# EAGLE design TiltyDuo (EAGLE 6.4)
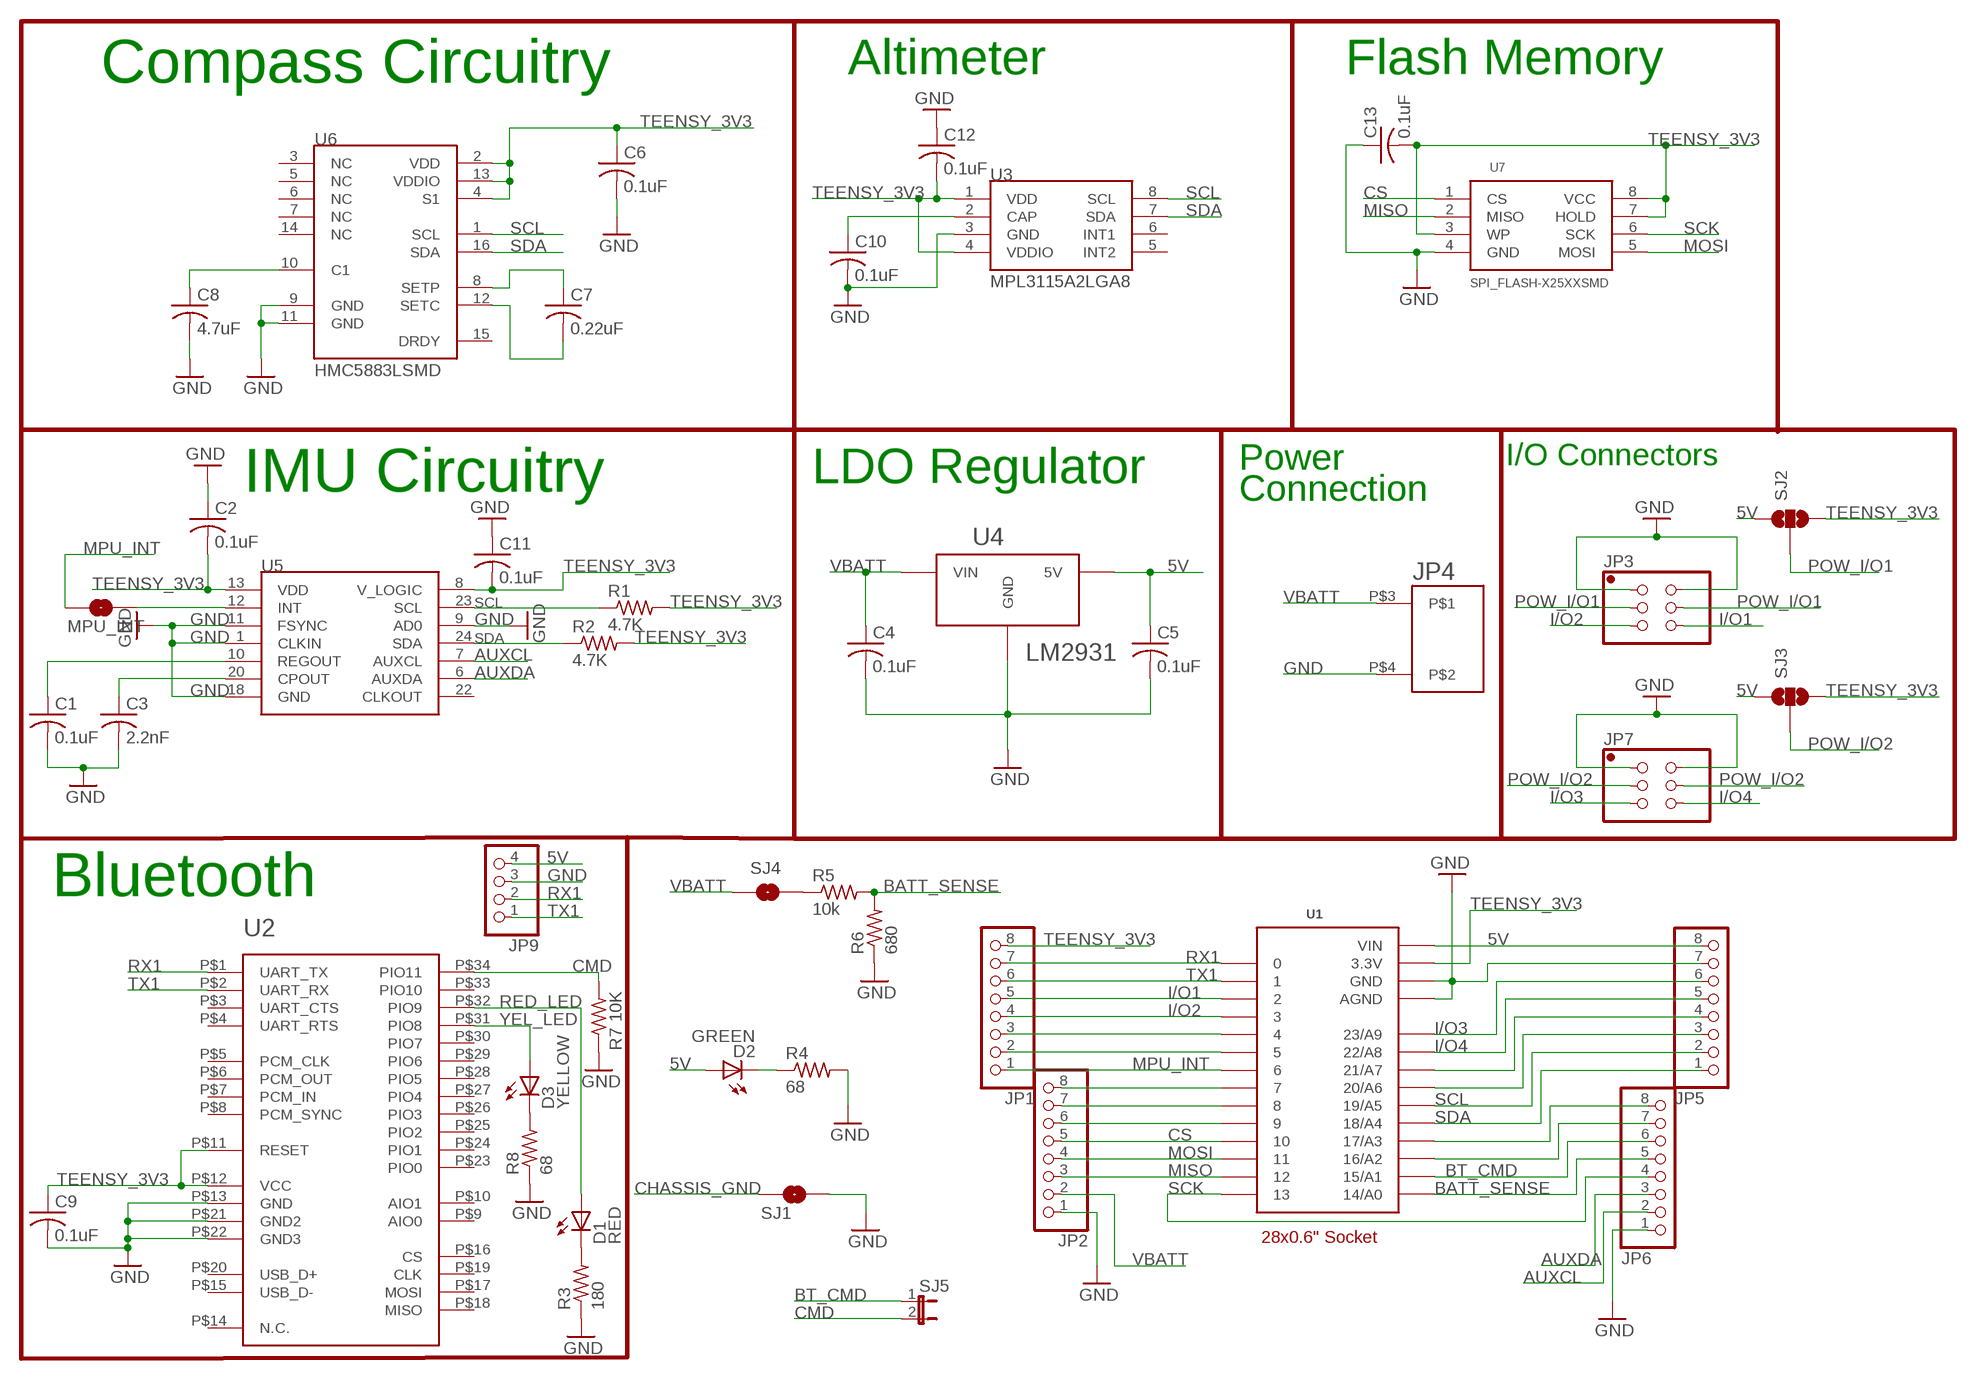
[diagram p0: schematic, sheet 1]

## Parts
C1  0.1uF  C-USC0603  [C0603]
C2  0.1uF  C-USC0603  [C0603]
C3  2.2nF  C-USC0603  [C0603]
C4  0.1uF  C-USC0603  [C0603]
C5  0.1uF  C-USC0603  [C0603]
C6  0.1uF  C-USC0603  [C0603]
C7  0.22uF  C-USC0603  [C0603]
C8  4.7uF  C-USC0603  [C0603]
C9  0.1uF  C-USC0603  [C0603]
C10  0.1uF  C-USC0603  [C0603]
C11  0.1uF  C-USC0603  [C0603]
C12  0.1uF  C-USC0603  [C0603]
C13  0.1uF  C-USC0603  [C0603]
D1  RED  LED-GREENLED-0805_NO_SILK  [LED-0805]
D2  GREEN  LED-GREENLED-0805_NO_SILK  [LED-0805]
D3  YELLOW  LED-GREENLED-0805_NO_SILK  [LED-0805]
JP1  PINHD-1X81X08_NO_SILK_LOCK  [1X08_NO_SS_LOCKING]
JP2  PINHD-1X81X08_NO_SILK_LOCK  [1X08_NO_SS_LOCKING]
JP3  PINHD-2X32X03_NO_SS_LOCK  [2X03_NO_SS_LOCK]
JP4  2-POS_SMD_TERM_BLOCK  [2-POS_SMD_TERMINAL_BLOCK]
JP5  PINHD-1X81X08_NO_SILK_LOCK  [1X08_NO_SS_LOCKING]
JP6  PINHD-1X81X08_NO_SILK_LOCK  [1X08_NO_SS_LOCKING]
JP7  PINHD-2X32X03_NO_SS_LOCK  [2X03_NO_SS_LOCK]
JP9  PINHD-1X41X04_NO_SS_LOCKING  [1X04_NO_SS_LOCKING]
MPU_INT  SOLDERJUMPERNO  [SJ_2S-NO]
R1  4.7K  R-US_R0603  [R0603]
R2  4.7K  R-US_R0603  [R0603]
R3  180  R-US_R0603  [R0603]
R4  68  R-US_R0603  [R0603]
R5  10k  R-US_R0603  [R0603]
R6  680  R-US_R0603  [R0603]
R7  10K  R-US_R0603  [R0603]
R8  68  R-US_R0603  [R0603]
SJ1  SOLDERJUMPERNO  [SJ_2S-NO]
SJ2  SOLDERJUMPER_2WAYS  [SJ_3]
SJ3  SOLDERJUMPER_2WAYS  [SJ_3]
SJ4  SOLDERJUMPERTRACE  [SJ_2S-TRACE]
SJ5  JUMPER-2SMD-NC  [SJ_2S]
U1  TEENSY_3.0_OUTER-PINS28-DIP_SOCKET  [28-DIP]
U2  HC-09_BREAKOUT  [HC-09_BREAKOUT]
U3  MPL3115A2LGA8  [LGA8]
U4  LM2931  [TO263]
U5  MPU-6050  [QFN-24]
U6  HMC5883LSMD  [16LPCC]
U7  SPI_FLASH-X25XXSMD  [SO08]

## Nets
5V: C5.1 D2.1(A) JP5.8 JP9.4 SJ2.1 SJ3.1 U1.P$15(VIN) U4.P$3(5V)
AUXCL [I/O]: JP6.2 U5.7(AUXCL)
AUXDA [I/O]: JP6.3 U5.6(AUXDA)
BATT_SENSE: JP6.5 R5.2 R6.2 U1.P$27(14/A0)
BT_CMD: JP6.6 SJ5.1 U1.P$26(15/A1)
CHASSIS_GND: SJ1.1
CMD: R7.2 SJ5.2 U2.P$34(PIO11)
CS: JP2.5 U1.P$12 U7.1(CS)
GND: C1.2 C2.1 C3.2 C4.2 C5.2 C6.2 C8.2 C9.2 C10.2 C11.1 C12.1 C13.1 JP2.1 JP3.1 JP3.2 JP4.P$4 JP5.7 JP6.1 JP7.1 JP7.2 JP9.3 R3.1 R4.2 R6.1 R7.1 R8.1 SJ1.2 U1.P$1(GND) U1.P$16(AGND) U2.P$13(GND) U2.P$21(GND2) U2.P$22(GND3) U3.3(GND) U4.P$1(GND) U5.1(CLKIN) U5.9(AD0) U5.11(FSYNC) U5.18(GND) U6.9(GND) U6.11(GND) U7.4(GND)
I/O1: JP1.5 JP3.6 U1.P$4
I/O2: JP1.4 JP3.5 U1.P$5
I/O3: JP5.6 JP7.5 U1.P$18(23/A9)
I/O4: JP5.5 JP7.6 U1.P$19(22/A8)
MISO: JP2.3 U1.P$14 U7.2(MISO)
MOSI: JP2.4 U1.P$13 U7.5(MOSI)
MPU_INT: JP1.1 MPU_INT.1 U1.P$8
N$1: C1.1 U5.10(REGOUT)
N$2: C3.1 U5.20(CPOUT)
N$3: D1.2(C) R3.2
N$5: C7.1 U6.8(SETP)
N$6: C7.2 U6.12(SETC)
N$7: JP1.3 U1.P$6
N$8: JP1.2 U1.P$7
N$9: R5.1 SJ4.2
N$10: JP6.8 U1.P$24(17/A3)
N$11: C8.1 U6.10(C1)
N$12: JP2.6 U1.P$11
N$13: D2.2(C) R4.1
N$16: MPU_INT.2 U5.12(INT)
N$18: JP5.4 U1.P$20(21/A7)
N$19: JP5.3 U1.P$21(20/A6)
N$21: C10.1 U3.2(CAP)
N$23: JP6.7 U1.P$25(16/A2)
N$24: D3.2(C) R8.2
POW_I/O1: JP3.3 JP3.4 SJ2.2
POW_I/O2: JP7.3 JP7.4 SJ3.2
RED_LED: D1.1(A) U2.P$32(PIO9)
RX1: JP1.7 JP9.2 U1.P$2 U2.P$1(UART_TX)
RX3: JP2.8 U1.P$9
SCK: JP6.4 U1.P$28 U7.6(SCK)
SCL [I/O]: JP5.2 R1.1 U1.P$22(19/A5) U3.8(SCL) U5.23(SCL) U6.1(SCL)
SDA [I/O]: JP5.1 R2.1 U1.P$23(18/A4) U3.7(SDA) U5.24(SDA) U6.16(SDA)
TEENSY_3V3 [3.3V]: C2.2 C6.1 C9.1 C11.2 C12.2 C13.2 JP1.8 R1.2 R2.2 SJ2.3 SJ3.3 U1.P$17(3.3V) U2.P$11(RESET) U2.P$12(VCC) U3.1(VDD) U3.4(VDDIO) U5.8(V_LOGIC) U5.13(VDD) U6.2(VDD) U6.4(S1) U6.13(VDDIO) U7.3(WP) U7.7(HOLD) U7.8(VCC)
TX1: JP1.6 JP9.1 U1.P$3 U2.P$2(UART_RX)
TX3: JP2.7 U1.P$10
VBATT: C4.1 JP2.2 JP4.P$3 SJ4.1 U4.P$2(VIN)
YEL_LED: D3.1(A) U2.P$31(PIO8)
Unconnected: U2.P$3(UART_CTS) U2.P$4(UART_RTS) U2.P$5(PCM_CLK) U2.P$6(PCM_OUT) U2.P$7(PCM_IN) U2.P$8(PCM_SYNC) U2.P$9(AIO0) U2.P$10(AIO1) U2.P$14(N.C.) U2.P$15(USB_D-) U2.P$16(CS) U2.P$17(MOSI) U2.P$18(MISO) U2.P$19(CLK) U2.P$20(USB_D+) U2.P$23(PIO0) U2.P$24(PIO1) U2.P$25(PIO2) U2.P$26(PIO3) U2.P$27(PIO4) U2.P$28(PIO5) U2.P$29(PIO6) U2.P$30(PIO7) U2.P$33(PIO10) U3.5(INT2) U3.6(INT1) U5.22(CLKOUT) U6.3(NC) U6.5(NC) U6.6(NC) U6.7(NC) U6.14(NC) U6.15(DRDY)

## Notes on the sheet
- Compass Circuitry | Altimeter | Flash Memory
- Power | I/O Connectors
- IMU Circuitry | LDO Regulator
- Connection
- Bluetooth
- 28x0.6" Socket

## Library data of the parts
C1 C6 C9 C10 C13 = resistor:C-US: CAPACITOR, American symbol; RATED_VOLTAGE: 2
C2 C4 C5 C11 C12 = resistor:C-US: CAPACITOR, American symbol
C3 = resistor:C-US: CAPACITOR, American symbol; RATED_VOLTAGE: 50
C7 C8 = resistor:C-US: CAPACITOR, American symbol; ESR: <200mOhms
D1-D3 = SparkFun-LED:LED-GREEN: Various green LEDs 0603- DIO-00821 LARGE- DIO-00862 LILYPAD- DIO-09910
JP1 JP2 JP5 JP6 = pinhead:PINHD-1X8: PIN HEADER
JP3 JP7 = pinhead:PINHD-2X3: PIN HEADER
JP4 = My Parts:2-POS_SMD_TERM_BLOCK; PART#: 277-2337-1-ND; POSSIBLE_ALT: 009276002021106
JP9 = pinhead:PINHD-1X4: PIN HEADER
MPU_INT SJ1 SJ4 = SparkFun-Passives:SOLDERJUMPER: Solder Jumper Standard SMD solder jumper. Used to automate production. Two varients : Normally Open and Normally Closed are the same, but have different paste layers. NC will have a large amount of paste and should jumper during reflow.
R1-R8 = resistor:R-US_: RESISTOR, American symbol
SJ2 SJ3 = SparkFun-Passives:SOLDERJUMPER_2WAY: Solder Jumper 2 way solder jumper
SJ5 = SparkFun-Passives:JUMPER-2: Jumper Basic 0.1" spaced jumper. Use with breakaway headers.
U1 = My Parts:TEENSY_3.0_OUTER-PINS; COST: 0.28; PART#: AE10004-ND; PART#2: A28-LC-TR-R
U2 = csr:HC-09_BREAKOUT
U3 = SparkFun-Sensors:MPL3115A2: Altimeter/Pressure Sensor, I2C, 1.95V-3.6V supply, 50 to 110kPa
U4 = on-semiconductor:LM2931; COST: 0.53
U5 = SparkFun-Sensors:MPU-6050: MPU-6000 - I2C address is 0x68 with AD0 low and 0x69 with AD0 high.
U6 = SparkFun:HMC5883L: 3 Axis Digital Compass IC
U7 = SparkFun-DigitalIC:SPI_FLASH-X25XX: 8pin SPI Flash series x25xx. Works with devices like W25X32 and BR25L32; PART#: S25FL204K0TMFI043

## Board
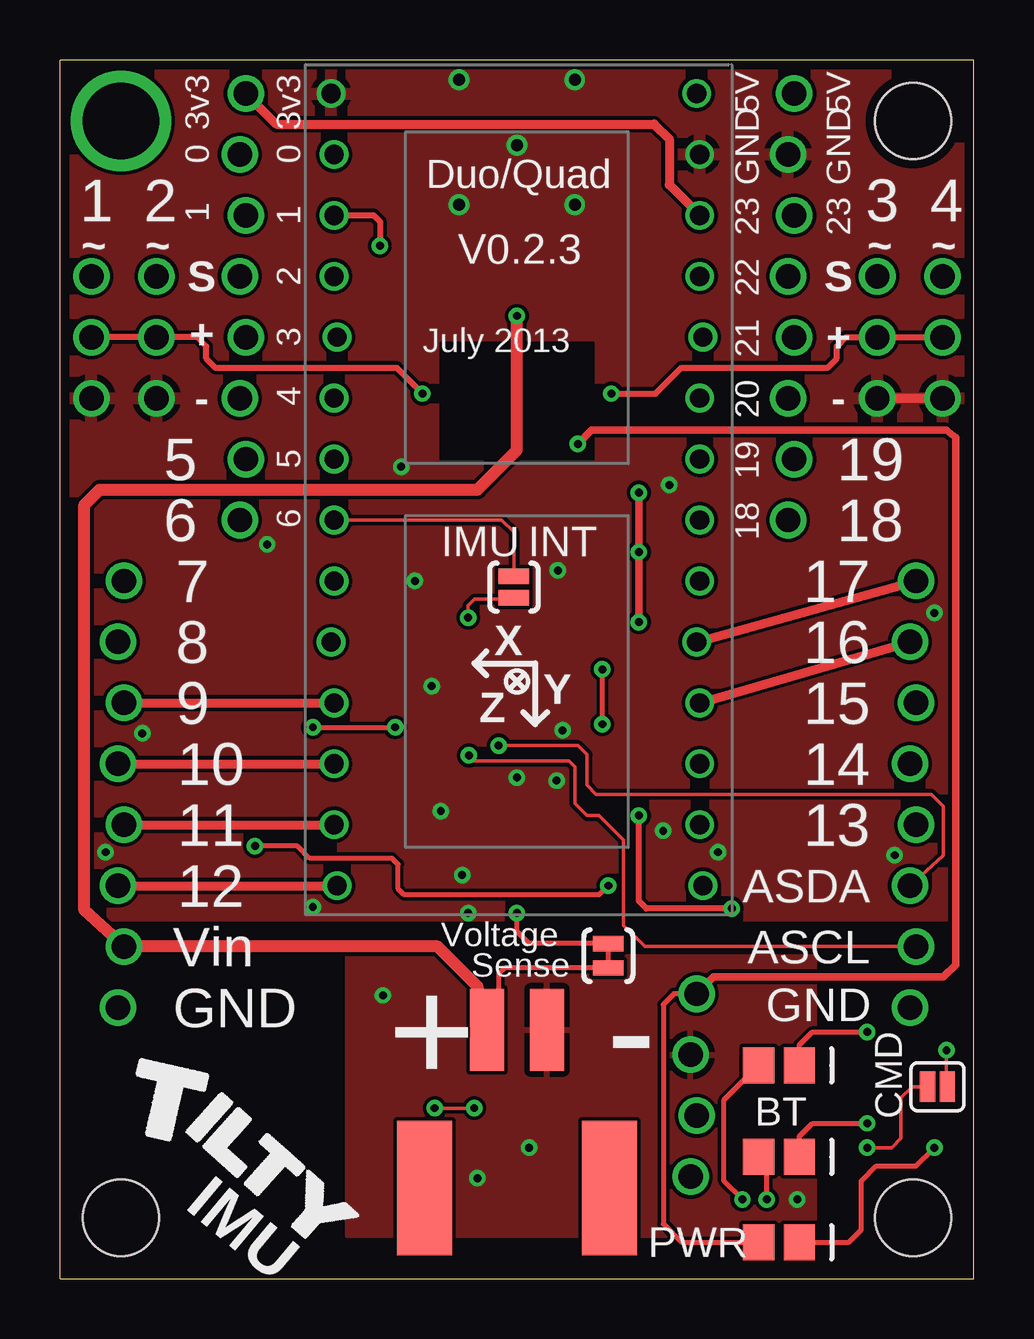
[diagram p1: board, top side]
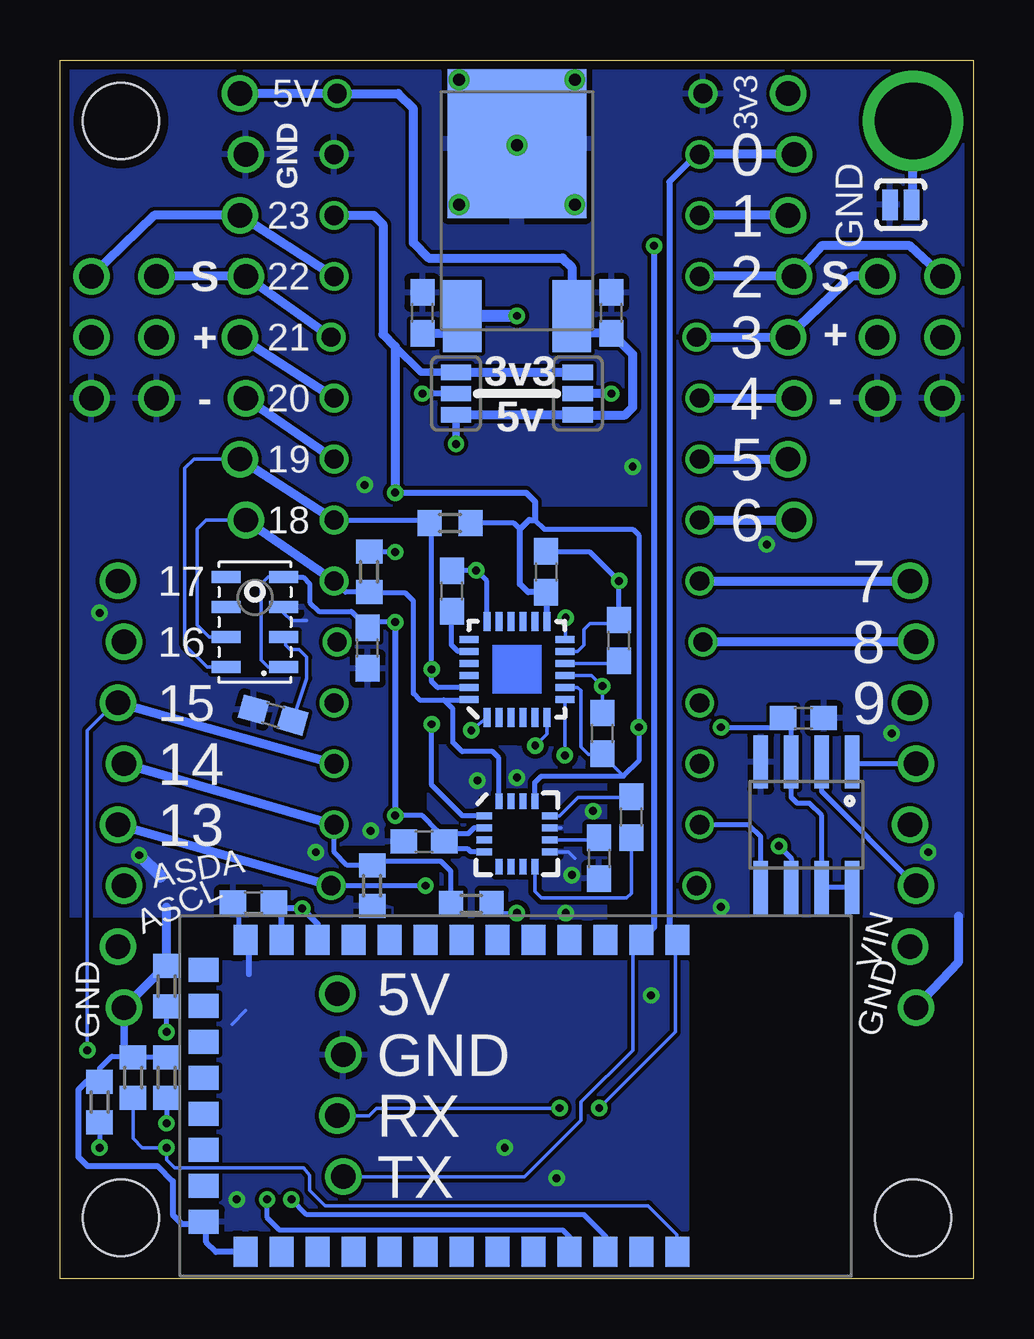
[diagram p2: board, bottom side, seen from below]

Size 38.1 x 50.8 mm. Coordinates in mm from the lower left corner, seen from the top.
Outline: 0,0 38.1,0 38.1,50.8 0,50.8 0,0
Copper layers (1*16): Top 0.0356mm / dielectric 1.5011mm / Bottom 0.0356mm
Design rules "LaenPCBOrder": minimum track width 6mil, minimum drill 13mil, track to track 6mil, track to pad 6mil, pad to pad 6mil, via to via 6mil, smd to smd 6mil, copper to edge 15mil, drill to drill 6mil, minimum pad ring 7mil, minimum via ring 7mil, stop-mask expansion 4mil, vias tented up to drill 0mil, thermal gap 10mil
Holes 3.17 mm at 35.56,48.26 35.56,2.54 2.54,2.54

### Footprints (pad centres in the part's own frame; a part is rotated, then mirrored left to right if it is on the bottom)
C0603 = smd 1.1 x 1: 1 -0.85,0; 2 0.85,0
LED-0805 = smd 1.3 x 1.5: 1 -0.85,0; 2 0.85,0
1X08_NO_SS_LOCKING = drill 1.016: 1 -8.89,0.127; 2 -6.35,-0.127; 3 -3.81,0.127; 4 -1.27,-0.127; 5 1.27,0.127; 6 3.81,-0.127; 7 6.35,0.127; 8 8.89,-0.127
2X03_NO_SS_LOCK = drill 1.016: 1 -2.54,-1.359; 2 -2.54,1.359; 3 0,-1.359; 4 0,1.359; 5 2.54,-1.359; 6 2.54,1.359
2-POS_SMD_TERMINAL_BLOCK = smd 2.3 x 5.6: P$1 -3.85,-2.325; P$2 3.85,-2.325 | smd 1.4 x 3.4: P$3 -1.25,4.275; P$4 1.25,4.275
1X04_NO_SS_LOCKING = drill 1.016: 1 -3.81,0.127; 2 -1.27,-0.127; 3 1.27,0.127; 4 3.81,-0.127
SJ_2S-NO = smd 0.635 x 1.27: 1 -0.45,0; 2 0.45,0
R0603 = smd 1 x 1.1: 1 -0.85,0; 2 0.85,0
SJ_3 = smd 0.635 x 1.27: 1 -0.889,0; 2 0,0; 3 0.889,0
SJ_2S-TRACE = smd 0.635 x 1.27: 1 -0.508,0; 2 0.508,0
SJ_2S = smd 0.635 x 1.27: 1 -0.412,0; 2 0.412,0
28-DIP = drill 0.8: P$1 -7.747,16.51; P$2 -7.62,13.97; P$3 -7.62,11.43; P$4 -7.62,8.89; P$5 -7.493,6.35; P$6 -7.62,3.81; P$7 -7.62,1.27; P$8 -7.62,-1.27; P$9 -7.62,-3.81; P$10 -7.747,-6.35; P$11 -7.62,-8.89; P$12 -7.62,-11.43; P$13 -7.62,-13.97; P$14 -7.493,-16.51; P$15 7.493,16.51; P$16 7.62,13.97; P$17 7.62,11.43; P$18 7.62,8.89; P$19 7.747,6.35; P$20 7.62,3.81; P$21 7.62,1.27; P$22 7.62,-1.27; P$23 7.62,-3.81; P$24 7.493,-6.35; P$25 7.62,-8.89; P$26 7.62,-11.43; P$27 7.62,-13.97; P$28 7.747,-16.51
HC-09_BREAKOUT = smd 1.25 x 1: P$1 -6.5,10.5; P$2 -6.5,9; P$3 -6.5,7.5; P$4 -6.5,6; P$5 -6.5,3; P$6 -6.5,4.5; P$7 -6.5,1.5; P$8 -6.5,0; P$9 -6.5,-1.5; P$10 -6.5,-3; P$11 -6.5,-4.5; P$12 -6.5,-6; P$13 -6.5,-7.5; P$22 6.5,-7.5; P$23 6.5,-6; P$24 6.5,-4.5; P$25 6.5,-3; P$26 6.5,-1.5; P$27 6.5,0; P$28 6.5,1.5; P$29 6.5,3; P$30 6.5,4.5; P$31 6.5,6; P$32 6.5,7.5; P$33 6.5,9; P$34 6.5,10.5 | smd 1 x 1.25: P$14 -5.25,-9.25; P$15 -3.75,-9.25; P$16 -2.25,-9.25; P$17 -0.75,-9.25; P$18 0.75,-9.25; P$19 2.25,-9.25; P$20 3.75,-9.25; P$21 5.25,-9.25
LGA8 = smd 1.2 x 0.5: 1 -1.2,1.875; 2 -1.2,0.625; 3 -1.2,-0.625; 4 -1.2,-1.875; 5 1.2,-1.875; 6 1.2,-0.625; 7 1.2,0.625; 8 1.2,1.875
TO263 = smd 5.791 x 6.198: P$1 0,2.794 | smd 1.6 x 2.997: P$2 -2.286,-4.394; P$3 2.286,-4.394
QFN-24 = smd 0.8 x 0.3: 1 -2,1.25; 2 -2,0.75; 3 -2,0.25; 4 -2,-0.25; 5 -2,-0.75; 6 -2,-1.25; 13 2,-1.25; 14 2,-0.75; 15 2,-0.25; 16 2,0.25; 17 2,0.75; 18 2,1.25 | smd 0.3 x 0.8: 7 -1.25,-2; 8 -0.75,-2; 9 -0.25,-2; 10 0.25,-2; 11 0.75,-2; 12 1.25,-2; 19 1.25,2; 20 0.75,2; 21 0.25,2; 22 -0.25,2; 23 -0.75,2; 24 -1.25,2
16LPCC = smd 0.65 x 0.28: 1 -1.37,0.75; 2 -1.37,0.25; 3 -1.37,-0.25; 4 -1.37,-0.75; 9 1.37,-0.75; 10 1.37,-0.25; 11 1.37,0.25; 12 1.37,0.75 | smd 0.28 x 0.65: 5 -0.75,-1.37; 6 -0.25,-1.37; 7 0.25,-1.37; 8 0.75,-1.37; 13 0.75,1.37; 14 0.25,1.37; 15 -0.25,1.37; 16 -0.75,1.37
SO08 = smd 0.61 x 2.21: 1 -1.905,-2.616; 2 -0.635,-2.616; 3 0.635,-2.616; 4 1.905,-2.616; 5 1.905,2.616; 6 0.635,2.616; 7 -0.635,2.616; 8 -1.905,2.616

### Placement (x,y rotation side)
C1  14.8,26.61 90 bottom
C2  17.84,29.46 270 bottom
C3  21.75,28.66 90 bottom
C4  22.99,40.26 90 bottom
C5  15.11,40.26 90 bottom
C6  22.92,18.22 180 bottom
C7  14.29,19.24 90 bottom
C8  15.62,17.53 270 bottom
C9  30.04,15.68 180 bottom
C10  29.21,23.5 164.1 bottom
C11  15.49,22.73 270 bottom
C12  25.27,26.29 90 bottom
C13  7.11,23.37 180 bottom
D1  29.97,8.89 0 top
D2  29.97,1.52 0 top
D3  29.97,5.08 0 top
JP1  7.62,40.51 90 top
JP2  2.54,20.19 90 top
JP3  2.67,39.24 90 top
JP4  19.05,6.1 0 top
JP5  30.48,40.51 90 top
JP6  35.56,20.19 90 top
JP7  35.43,39.24 90 top
JP9  26.42,8.06 90 top
MPU_INT  18.92,28.83 270 top
R1  21.84,31.5 0 bottom
R2  25.21,29.46 90 bottom
R3  33.66,12.19 270 bottom
R4  36.45,7.37 90 bottom
R5  20.95,15.62 180 bottom
R6  25.08,16.38 90 bottom
R7  35.05,8.38 270 bottom
R8  33.66,8.38 270 bottom
SJ1  3.05,44.77 180 bottom
SJ2  16.51,36.89 90 bottom
SJ3  21.59,36.89 90 bottom
SJ4  22.86,13.46 90 top
SJ5  36.58,8 180 top
U1  19.05,32.89 0 top
U2  22.86,7.62 270 bottom
U3  29.97,27.37 180 bottom
U4  19.05,44.51 0 bottom
U5  19.05,25.4 90 bottom
U6  19.05,18.54 0 bottom
U7  6.99,18.92 180 bottom

### Tracks (layer width: path | path; a pad name or v marks a point on that pad's centre or on a via)
5V  (via drill 0.33)
  Top 0.203: D2.1 25.91,1.52 25.15,2.29 25.15,11.43 25.59,11.87 JP9.4
  Top 0.305: 36.83,12.57 37.34,13.08
  Top 0.318: 37.34,13.08 37.34,35.05 36.96,35.37 22.16,35.37 v21.59,34.8 | 36.83,12.57 27.24,12.57 JP9.4
  Bottom 0.318: SJ3.1 v21.59,34.8
  Bottom 0.381: JP5.8 U1.P$15 24,49.4 23.37,48.77 23.37,43.18 22.73,42.55 17.14,42.55 16.76,42.16 U4.P$3 16.76,39.41 C5.1 14.22,38.52 14.22,36.32 14.54,36.01 SJ2.1 SJ3.1
  Bottom 0.508: 16.75,40.17 U4.P$3 16.71,40.17
AUXCL  (via drill 0.33)
  Top 0.152: v17.05,21.81 17.27,21.59 21.21,21.59 21.46,21.34 21.46,19.81 21.97,19.3 22.48,19.3 23.5,18.29 23.5,14.73 24.38,13.84 JP6.2
  Bottom 0.152: U5.7 v17.05,21.81
AUXDA  (via drill 0.33)
  Top 0.152: JP6.3 36.83,17.65 36.83,19.68 36.32,20.19 22.35,20.19 21.97,20.57 21.97,21.84 21.59,22.23 v18.29,22.23
  Bottom 0.152: 17.78,23.38 U5.6 17.8,22.71 v18.29,22.23
BATT_SENSE
  Bottom 0.203: 24.99,17.46 R6.2 | R6.2 26.12,17.23 26.67,17.78 U1.P$27 | R5.2 21.8,16.98 22.23,17.4 25.04,17.4 R6.2
  Bottom 0.381: U1.P$27 JP6.5
BT_CMD  (via drill 0.33)
  Top 0.152: v36.96,9.53 36.96,8.03 SJ5.1
  Bottom 0.152: JP6.6 35.81,24 36.96,22.86 v36.96,9.53
  Bottom 0.381: U1.P$26 JP6.6
CHASSIS_GND  (via drill 3.17)
  Bottom 0.381: SJ1.1 2.6,44.96 2.54,45.02 v2.54,48.26
CMD  (via drill 0.33)
  Top 0.152: v33.66,5.46 34.67,5.46 35.05,5.84 R7.2 35.52,8 SJ5.2
  Bottom 0.152: U2.P$34 12.38,1.1 12.38,1.84 13.59,3.05 27.05,3.05 27.69,3.68 27.69,4.32 27.94,4.62 33.33,4.62 33.66,4.95 v33.66,5.46 34.67,5.46 35.05,5.84 R7.2 | 12.38,1.14 U2.P$34 | 12,0.64 U2.P$34
CS
  Top 0.381: JP2.5 U1.P$12
  Bottom 0.203: JP2.5 5,21.46 U7.1
GND  (via drill 0.33, 0.51 pad 0.18)
  Top 0.381: JP7.2 JP7.1
  Bottom 0.152: U5.9 15.94,25.15 v15.49,24.7 C11.1 | 30.92,10.6 30.35,11.18 | U6.9 16.9,17.79 16.64,17.53 | U5.11 16.52,26.15 16.26,26.42 16.26,27.05 16,27.3 15.07,27.3 C1.2 | U3.3 28.77,27.76 28.45,27.43 27.81,27.43 | U6.11 17.47,18.79 17.21,18.8 | 20.32,23.38 v20.95,22.86
  Bottom 0.203: U2.P$13 30.63,14.39 30.63,15.43 C9.2 | C2.1 17.82,30.29 16,30.29 v14.8,29.08 C1.2 | U5.18 20.3,29.08 v20.75,29.53 21.74,29.53 C3.2 | R8.1 R7.1 35.09,9.27 35.94,9.27 36.45,8.76 R4.2
  Bottom 0.254: 20.32,23.38 U5.1 | U2.P$22 31.6,1.12 32,1.52 32,2.26 U2.P$21 32.19,2.29 33.02,2.29 33.4,2.67 33.4,4.06 34.04,4.7 36.96,4.7 37.34,5.08 37.34,7.87 37,8.22 R4.2 | U2.P$13 | U2.P$13 30.36,13.98 | U2.P$13 30.23,14.11 30.23,12.7 | 30.57,14.33 U2.P$13 | 15.47,16.7 C8.2
  Bottom 0.318: JP6.1 35.43,9.61 R7.1
  Bottom 0.381: JP2.1 0.64,13.21 0.64,15.11 | JP6.1 33.72,13.02 R3.1 33.66,15.49
  Bottom 0.508: 33.91,16.76 v34.8,17.65
  other vias: 19.05,47.24 16.64,44.77 21.46,44.77 21.46,49.97 16.64,49.97 15.88,19.49 17.4,4.19 13.46,11.81 16.76,16.83 25.15,18.67 25.4,33.08 8.64,30.61 14.22,33.85 27.43,17.78 19.56,5.46 1.91,17.78 3.43,22.73 30.73,3.3 17.02,15.24 10.54,15.49 20.7,20.76 19.05,20.89 36.45,27.75
  pour Top (isolate 0.127): 0,50.8 38.1,50.8 38.1,15.11 0,15.11
  pour Bottom: 0,32.26 0,50.8 38.1,50.8 38.1,32.26
  pour Bottom: 0,32.26 13.59,32.26 13.59,15.11 0,15.11
  pour Bottom: 24.13,32.26 37.97,32.26 38.1,15.11 24.26,15.11
  pour Top: 11.94,13.46 31.5,13.46 31.5,1.78 11.94,1.78
  pour Bottom: 11.94,2.03 11.94,13.21 31.5,13.21 31.5,12.57 31.5,2.03
  pour Bottom (isolate 0.203): 15.37,22.1 22.73,22.23 22.73,15.11 15.37,14.99
  pour Bottom: 16,50.29 22.1,50.29 22.1,43.94 16,43.94
I/O1
  Bottom 0.381: U1.P$4 JP1.5 6.35,43.05 2.67,43.05 JP3.6
I/O2
  Bottom 0.381: U1.P$5 JP1.4 5.08,41.78 JP3.5
I/O3
  Bottom 0.381: U1.P$18 JP5.6 34.16,44.32 JP7.5
I/O4
  Bottom 0.381: U1.P$19 JP5.5 JP7.6
MISO
  Top 0.381: JP2.3 U1.P$14
  Bottom 0.203: JP2.3 6.35,20.32 U7.2
MOSI
  Top 0.381: JP2.4 U1.P$13
  Bottom 0.203: U7.5 8.89,18.41 9.4,18.92 U1.P$13
MPU_INT
  Top 0.152: U1.P$8 18.41,31.62 18.92,31.11 MPU_INT.1
  Bottom 0.381: U1.P$8 JP1.1
N$1
  Bottom 0.152: U5.10 14.9,25.65 C1.1
N$2
  Bottom 0.203: U5.20 21.52,26.15 21.78,26.42 21.78,27.79 C3.1
N$3  (via drill 0.33)
  Top 0.203: D1.2 30.82,9.74 31.37,10.29 v33.66,10.29
  Bottom 0.203: v33.66,10.29 R3.2
N$4
  cutout Bottom: 17.53,20.07 17.53,17.02 20.57,17.02 20.57,20.07
N$5
  Bottom 0.152: C7.1 14.29,16.07 14.48,15.88 18.03,15.88 18.3,16.14 U6.8
N$6
  Bottom 0.152: U6.12 17.28,19.29 16.51,20.07 14.31,20.07 C7.2
N$7
  Bottom 0.381: U1.P$6 JP1.3
N$8
  Bottom 0.381: U1.P$7 JP1.2
N$9  (via drill 0.33)
  Top 0.203: SJ4.2 19.56,13.97 19.05,14.48 v19.05,15.24
  Bottom 0.152: v19.05,15.24 19.72,15.24 R5.1
N$10
  Top 0.381: U1.P$24 JP6.8
N$11
  Bottom 0.152: U6.10 15.2,18.29 C8.1
N$12
  Top 0.381: JP2.6 U1.P$11
N$13  (via drill 0.33)
  Top 0.203: D2.2 32.89,1.52 33.4,2.03 33.4,4.06 34.04,4.7 35.69,4.7 v36.45,5.46
  Bottom 0.203: R4.1 v36.45,5.46
N$16  (via drill 0.33)
  Top 0.152: v17.02,27.56 17.02,28.07 17.27,28.32 18.86,28.32 MPU_INT.2
  Bottom 0.152: v17.02,27.56 17.02,26.68 U5.12
N$18
  Bottom 0.381: U1.P$20 JP5.4
N$19
  Bottom 0.381: U1.P$21 JP5.3
N$20
  cutout Top: 15.88,38.99 22.23,38.99 22.23,34.16 15.88,34.16
N$21
  Bottom 0.152: 28.78,26.86 U3.2 28.7,26.8 28.7,26.42 28.51,26.23 28.13,26.23 27.81,25.91 27.81,25.02 C10.1
N$23
  Top 0.381: U1.P$25 JP6.7
N$24  (via drill 0.33)
  Top 0.203: D3.2 30.82,5.93 31.37,6.48 v33.66,6.48
  Bottom 0.203: R8.2 v33.66,6.48
N$25
  cutout Bottom: 29.72,15.24 29.72,16.38 30.35,16.38 30.35,15.24
N$26
  cutout Bottom: 22.35,15.11 26.29,16.13 26.29,17.97 22.35,17.97
N$28
  cutout Bottom: 28.57,29.84 31.37,29.84 31.37,25.15 28.57,25.15
POW_I/O1  (via drill 0.33)
  Top 0.254: JP3.4 JP3.3 5.71,39.24 6.1,38.86 6.1,38.35 6.48,37.97 14.03,37.97 v15.11,36.89
  Bottom 0.381: v15.11,36.89 SJ2.2
POW_I/O2  (via drill 0.33)
  Top 0.254: JP7.3 JP7.4 32.77,39.24 32.38,38.86 32.38,38.35 32,37.97 25.91,37.97 24.83,36.89 v22.99,36.89
  Bottom 0.254: SJ3.2 v22.99,36.89
RED_LED  (via drill 0.33)
  Top 0.203: v28.45,3.3 27.69,4.06 27.69,7.45 D1.1
  Bottom 0.203: U2.P$32 15.36,1.77 16.26,2.67 27.81,2.67 v28.45,3.3
RX1  (via drill 0.33)
  Top 0.152: v17.27,7.11 v15.62,7.11
  Bottom 0.152: 12.38,14.1 U2.P$1 12.45,14.03 12.45,10.29 v15.62,7.11 | JP9.2 25.21,6.79 24.89,7.11 v17.27,7.11
  Bottom 0.254: U1.P$2 11.56,46.86 12.7,45.72 12.7,14.59 U2.P$1
  Bottom 0.381: JP1.7 U1.P$2
RX3
  Bottom 0.381: U1.P$9 JP2.8
SCK  (via drill 0.33)
  Top 0.203: v22.86,16.38 22.48,16 14.35,16 14.1,16.26 14.1,17.27 13.84,17.53 10.41,17.53 9.91,18.03 v8.13,18.03
  Bottom 0.203: v22.86,16.38 U1.P$28 | v8.13,18.03 7.62,17.53 U7.6
  Bottom 0.381: U1.P$28 JP6.4
SCL  (via drill 0.33)
  Top 0.203: 30.48,34.16 JP5.2 | v22.61,23.11 v22.61,25.4
  Bottom 0.152: JP5.2 32.51,34.16 32.89,33.78 32.89,26.42 31.97,25.49 U3.8
  Bottom 0.203: U5.23 21.06,24.64 22.35,24.64 22.61,24.89 v22.61,25.4 22.61,31.41 R1.1 22.82,31.62 U1.P$22 | U6.1 21.32,19.29 22.61,20.57 v22.61,23.11
  Bottom 0.381: U1.P$22 JP5.2
SDA
  Bottom 0.152: JP5.1 32,31.62 32.38,31.24 32.38,27.24 31.89,26.74 U3.7
  Bottom 0.203: 22.1,24.13 23.11,24.13 23.37,24.38 23.37,28.26 23.69,28.57 25.17,28.57 R2.1 26.2,28.61 U1.P$23 | 22.1,24.13 21.07,24.13 U5.24 | U6.16 19.8,21.7 20.07,21.97 21.34,21.97 21.72,22.35 21.72,23.75 22.1,24.13
  Bottom 0.381: U1.P$23 JP5.1
TEENSY_3V3  (via drill 0.33)
  Top 0.203: v10.54,22.99 v13.97,22.99
  Top 0.254: v28,15.43 24.45,15.43 24.13,15.75 v24.13,19.3
  Top 0.305: v24.13,32.77 v24.13,30.29 v24.13,27.37
  Top 0.381: JP1.8 9.02,48.13 24.77,48.13 25.4,47.5 25.4,45.59 U1.P$17
  Bottom 0.152: U5.8 16.52,24.65 16.38,24.51 16.38,22.16 16.07,21.84 15.53,21.84 | 15.53,21.84 C11.2 | 15.53,21.84 14.61,20.95 | U3.1 29.43,25.49 29.72,25.78 29.72,28.96 29.43,29.24 U3.4
  Bottom 0.203: U6.4 20.97,17.79 21.08,17.91 21.76,17.91 C6.1 | U6.2 20.83,18.79 21.08,18.54 21.76,18.54 C6.1 | 18.29,31.62 17.91,31.24 14.22,31.24 13.97,30.99 v13.97,22.99 13.97,21.59 14.61,20.95 18.03,20.95 18.3,20.69 U6.13 | C6.1 22.29,18.22 22.35,18.29 22.35,18.67 22.99,19.3 v24.13,19.3 | v24.13,27.37 25.04,27.37 C12.2 25.95,27.81 27.3,27.81 27.69,28.19 27.69,28.96 27.97,29.24 U3.4 28.74,29.34 | 18.92,31.24 19.18,31.5 R1.2 | v24.13,30.29 25.18,30.29 R2.2 | U7.8 U7.7 6.35,19.3 6.86,19.81 7.37,19.81 7.62,20.07 U7.3 7.62,23.37 C13.2 8.09,22.99 v10.54,22.99
  Bottom 0.254: U5.13 17.8,28.57 C2.2 18.58,28.61 18.92,28.96 18.92,31.24 18.54,31.62 18.29,31.62 18.29,32.38 18.67,32.77 v24.13,32.77 | U2.P$11 27.36,14.79 v28,15.43 28.93,15.43 C9.1 28.86,15.36 U2.P$12 | v24.13,27.37 v24.13,19.3
  Bottom 0.318: SJ3.3 23.05,37.78 24.13,38.86
  Bottom 0.381: v24.13,32.77 24.13,38.86 24.64,39.37 24.64,43.94 25.02,44.32 U1.P$17 | SJ3.3 SJ2.3
TX1  (via drill 0.33)
  Top 0.254: U1.P$3 13.08,44.32 13.34,44.07 v13.34,43.05
  Bottom 0.152: JP9.1 18.73,4.25 16.38,6.6 16.38,7.37 14.22,9.53 14.22,13.76 U2.P$2
  Bottom 0.254: v13.34,43.05 13.34,14.64 U2.P$2
  Bottom 0.381: JP1.6 U1.P$3
TX3
  Bottom 0.381: JP2.7 U1.P$10
VBATT  (via drill 0.33)
  Top 0.203: SJ4.1 18.54,12.95 18.29,12.7 18.29,10.86 JP4.P$3
  Top 0.508: JP4.P$3 17.4,10.77 17.4,12.19 15.75,13.84 JP2.2 1.02,15.37 1.02,32.26 1.65,32.89 17.4,32.89 19.05,34.54 v19.05,40.13
  Bottom 0.381: C4.1 21.34,39.41 U4.P$2
  Bottom 0.508: v19.05,40.13 21.29,40.13 U4.P$2 21.4,40.18
YEL_LED  (via drill 0.33)
  Top 0.203: v29.46,3.3 29.46,4.74 D3.1
  Bottom 0.203: U2.P$31 16.86,1.75 17.14,2.03 28.96,2.03 29.46,2.54 v29.46,3.3

### Text on the board
tNames: 5V | 5V | 3v3 | 3v3 | 0 | 0 | Duo/Quad | GND | GND | 1 | 2 | 3 | 4 | 1 | 1 | V0.2.3 | 23 | 23 | ~ | ~ | S | S | ~ | ~ | 2 | 22 | + | 3 | July 2013 | + | 21 | - | - | 4 | 20 | 5 | 5 | 19 | 19 | 6 | 18 | 6 | IMU | INT | 18 | 17 | 7 | 16 | 8 | X | Y | 15 | 9 | Z | 10 | 14 | 13 | 11 | ASDA | 12 | Vin | Voltage | ASCL | Sense | GND | GND | + | - | BT | CMD | IMU | PWR
bNames: 5V | 3v3 | GND | 0 | GND | 1 | 23 | S | 2 | 22 | S | + | 3 | 21 | + | 3v3 | - | 4 | 20 | - | 5v | 5 | 19 | 6 | 18 | 7 | 17 | 8 | 16 | 9 | 15 | 14 | 13 | ASDA | ASCL | VIN | 5V | GND | GND | GND | RX | TX